# EAGLE design controller (EAGLE 6.4)
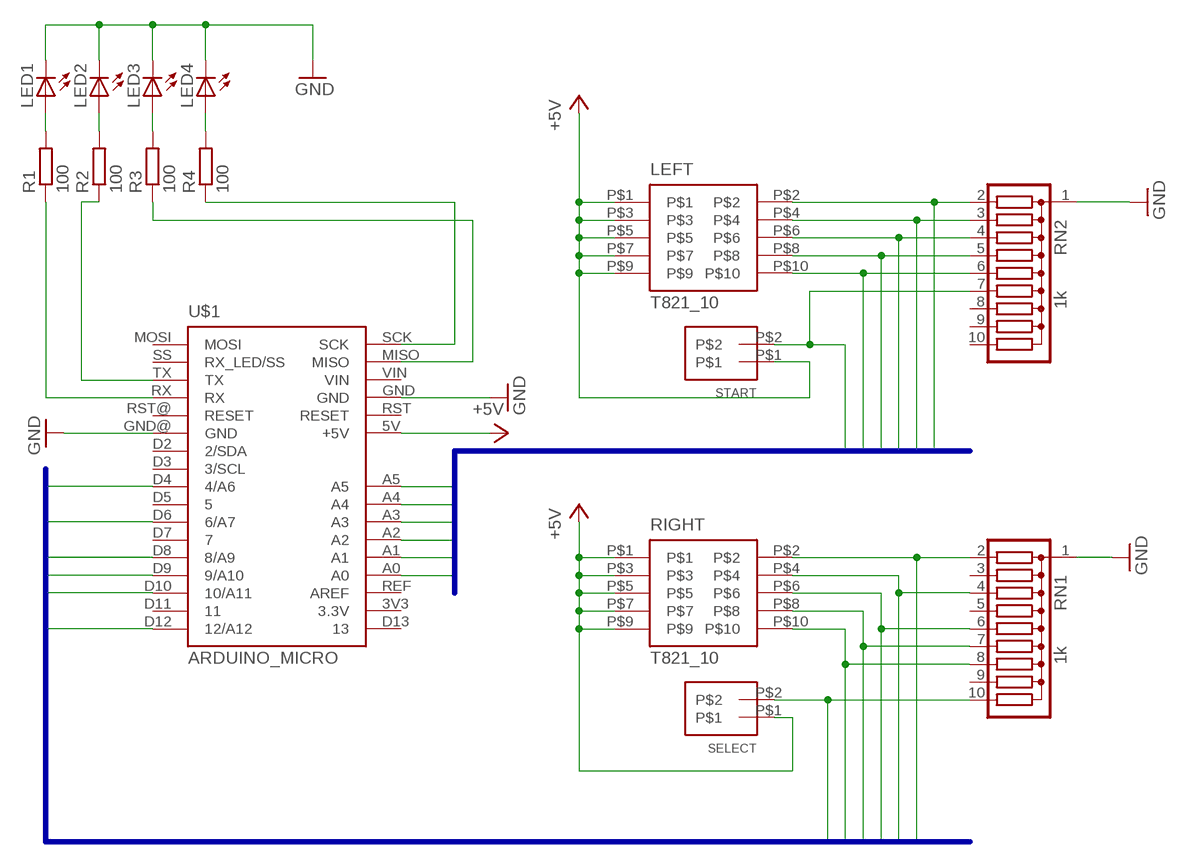
[diagram p0: schematic, sheet 1]

## Parts
LED1  LED5MM  [LED5MM]
LED2  LED5MM  [LED5MM]
LED3  LED5MM  [LED5MM]
LED4  LED5MM  [LED5MM]
LEFT  T821_10  [T821_10]
R1  100  R-EU_0204/7  [0204/7]
R2  100  R-EU_0204/7  [0204/7]
R3  100  R-EU_0204/7  [0204/7]
R4  100  R-EU_0204/7  [0204/7]
RIGHT  T821_10  [T821_10]
RN1  1k  G09R  [SIL10]
RN2  1k  G09R  [SIL10]
SELECT  100MIL_2POS  [100MIL_2POS]
START  100MIL_2POS  [100MIL_2POS]
U$1  ARDUINO_MICRO  [ARDUINO_MICRO]

## Nets
+5V: LEFT.P$1 LEFT.P$3 LEFT.P$5 LEFT.P$7 LEFT.P$9 RIGHT.P$1 RIGHT.P$3 RIGHT.P$5 RIGHT.P$7 RIGHT.P$9 SELECT.P$1 START.P$1 U$1.5V(+5V)
B0: LEFT.P$2 RN2.2 U$1.A0
B1: LEFT.P$4 RN2.3 U$1.A1
B2: LEFT.P$6 RN2.4 U$1.A2
B3: LEFT.P$8 RN2.5 U$1.A3
B4: LEFT.P$10 RN2.6 U$1.A4
B5: RN2.7 START.P$2 U$1.A5
B6: RIGHT.P$2 RN1.2 U$1.D4(4/A6)
B7: RIGHT.P$4 RN1.4 U$1.D6(6/A7)
B8: RIGHT.P$6 RN1.6 U$1.D8(8/A9)
B9: RIGHT.P$8 RN1.7 U$1.D9(9/A10)
B10: RIGHT.P$10 RN1.8 U$1.D10(10/A11)
B11: RN1.10 SELECT.P$2 U$1.D12(12/A12)
GND: LED1.K(C) LED2.K(C) LED3.K(C) LED4.K(C) RN1.1 RN2.1 U$1.GND U$1.GND@(GND)
N$1: LED1.A R1.2
N$2: LED2.A R2.2
N$3: LED3.A R3.2
N$4: LED4.A R4.2
N$6: R1.1 U$1.RX
N$7: R2.1 U$1.TX
N$8: R4.1 U$1.SCK
N$9: R3.1 U$1.MISO
Unconnected: RN1.3 RN1.5 RN1.9 RN2.8 RN2.9 RN2.10 U$1.3V3(3.3V) U$1.D2(2/SDA) U$1.D3(3/SCL) U$1.D5 U$1.D7 U$1.D11 U$1.D13 U$1.MOSI U$1.REF(AREF) U$1.RST(RESET) U$1.RST@(RESET) U$1.SS(RX_LED/SS) U$1.VIN

## Buses
B[0..5]
B[6..11]

## Library data of the parts
LED1-LED4 = led:LED: LED OSRAM: - CHIPLED LG R971, LG N971, LY N971, LG Q971, LY Q971, LO R971, LY R971 LH N974, LH R974 LS Q976, LO Q976, LY Q976 LO Q996 - Hyper CHIPLED LW Q18S LB Q993, LB Q99A, LB R99A - SideLED LS A670, LO A670, LY A670, LG A670, LP A670 LB A673, LV A673, LT A673, LW A673 LH A674 LY A675 LS A676, LA A676, LO A676, LY A676, LW A676 LS A679, LY A679, LG A679 - Hyper Micro SIDELED® LS Y876, LA Y876, LO Y876, LY Y876 LT Y87S - SmartLED LW L88C, LW L88S LB L89C, LB L89S, LG L890 LS L89K, LO L89K, LY L89K LS L896, LA L896, LO L896, LY L896 - TOPLED LS T670, LO T670, LY T670, LG T670, LP T670 LSG T670, LSP T670, LSY T670, LOP T670, LYG T670 LG T671, LOG T671, LSG T671 LB T673, LV T673, LT T673, LW T673 LH T674 LS T676, LA T676, LO T676, LY T676, LB T676, LH T676, LSB T676, LW T676 LB T67C, LV T67C, LT T67C, LS T67K, LO T67K, LY T67K, LW E67C LS E67B, LA E67B, LO E67B, LY E67B, LB E67C, LV E67C, LT E67C LW T67C LS T679, LY T679, LG T679 LS T770, LO T770, LY T770, LG T770, LP T770 LB T773, LV T773, LT T773, LW T773 LH T774 LS E675, LA E675, LY E675, LS T675 LS T776, LA T776, LO T776, LY T776, LB T776 LHGB T686 LT T68C, LB T68C - Hyper Mini TOPLED® LB M676 - Mini TOPLED Santana® LG M470 LS M47K, LO M47K, LY M47K Source: http://www.osram.convergy.de LUXEON: - LUMILED® LXK2-PW12-R00, LXK2-PW12-S00, LXK2-PW14-U00, LXK2-PW14-V00 LXK2-PM12-R00, LXK2-PM12-S00, LXK2-PM14-U00 LXK2-PE12-Q00, LXK2-PE12-R00, LXK2-PE12-S00, LXK2-PE14-T00, LXK2-PE14-U00 LXK2-PB12-K00, LXK2-PB12-L00, LXK2-PB12-M00, LXK2-PB14-N00, LXK2-PB14-P00, LXK2-PB14-Q00 LXK2-PR12-L00, LXK2-PR12-M00, LXK2-PR14-Q00, LXK2-PR14-R00 LXK2-PD12-Q00, LXK2-PD12-R00, LXK2-PD12-S00 LXK2-PH12-R00, LXK2-PH12-S00 LXK2-PL12-P00, LXK2-PL12-Q00, LXK2-PL12-R00 Source: www.luxeon.com KINGBRIGHT: KA-3528ASYC Source: www.kingbright.com
LEFT RIGHT = controller:T821_10
R1-R4 = resistor:R-EU_: RESISTOR, European symbol
RN1 RN2 = resistor-sil:G09R: SIL RESISTOR; OC_FARNELL: unknown; OC_NEWARK: unknown
SELECT START = controller:100MIL_2POS
U$1 = controller:ARDUINO_MICRO

## Board
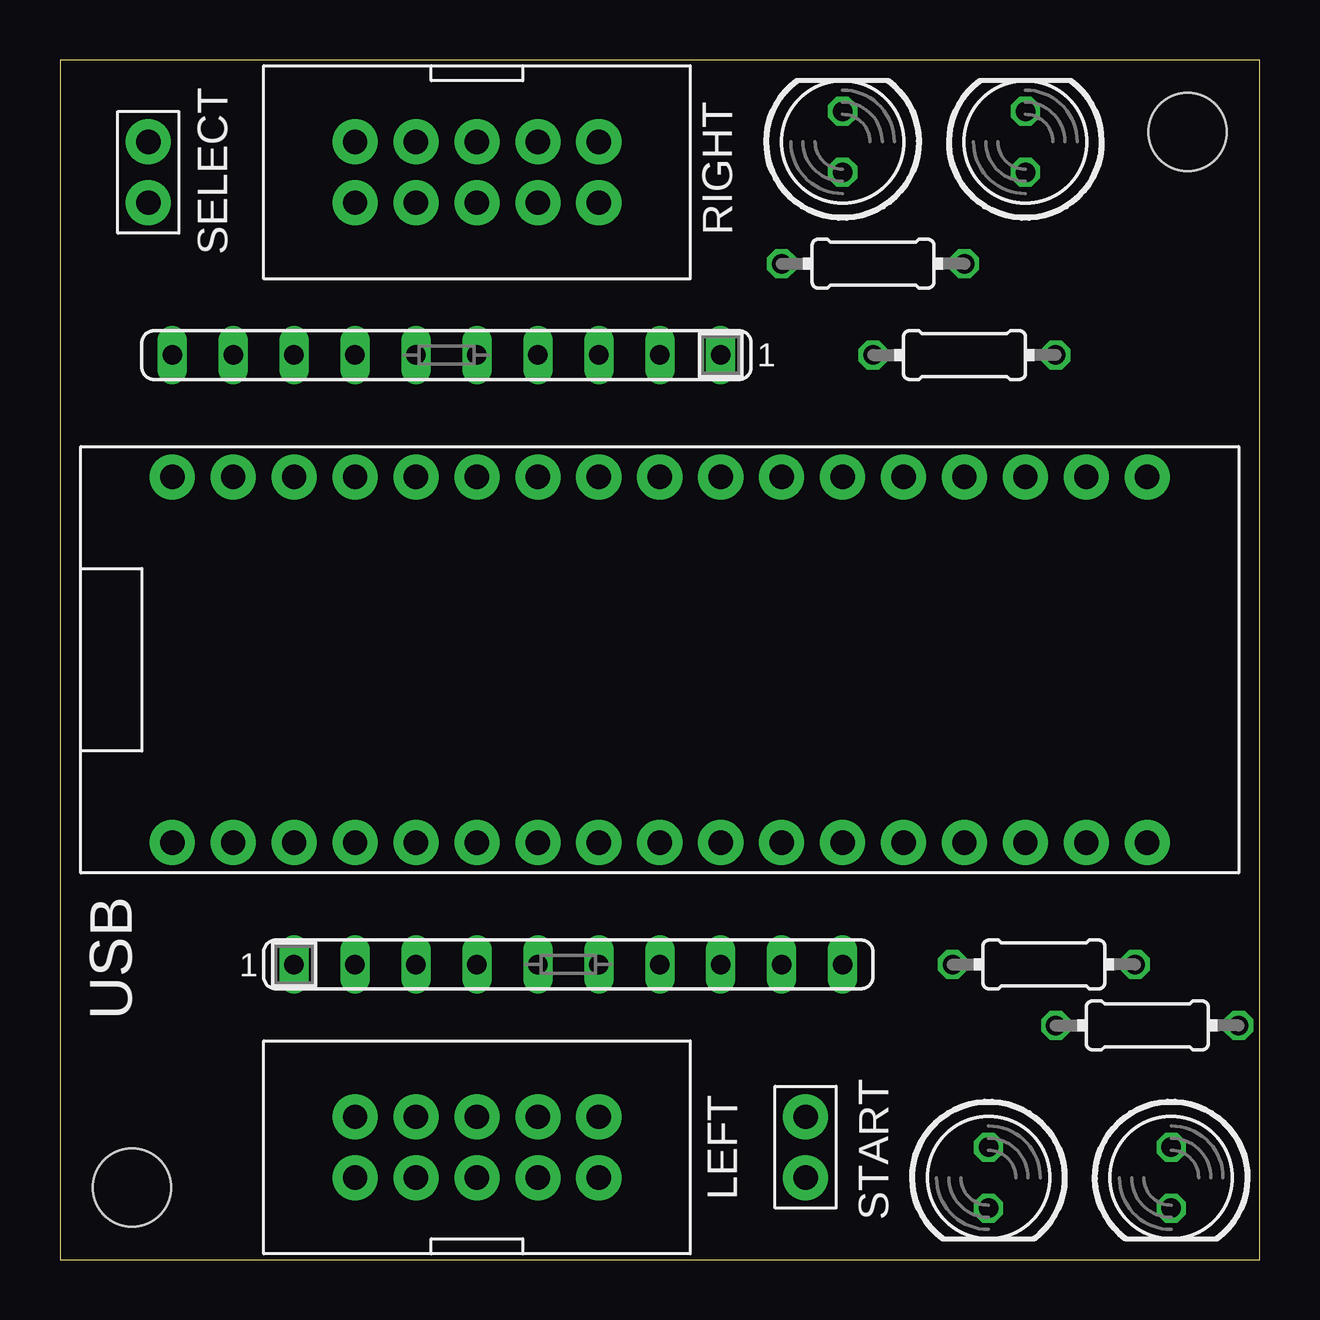
[diagram p1: board, top side]
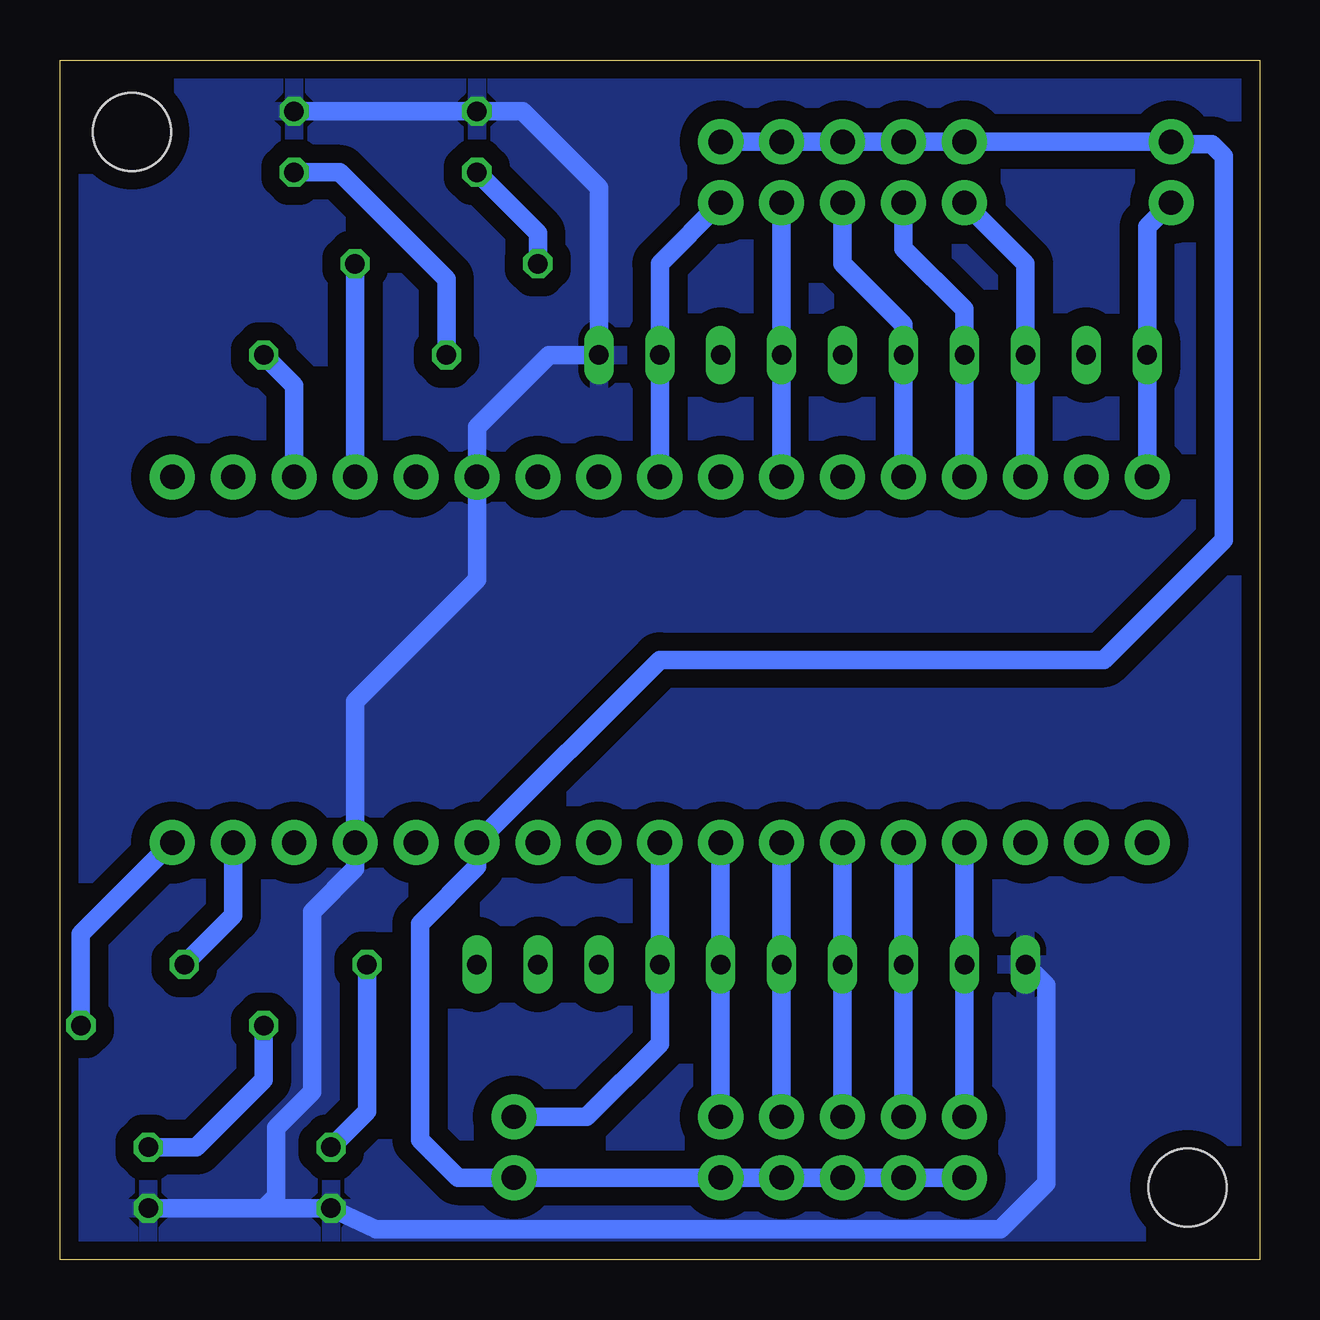
[diagram p2: board, bottom side, seen from below]

Size 50 x 50 mm. Coordinates in mm from the lower left corner, seen from the top.
Outline: 0,0 50,0 50,50 0,50 0,0
Copper layers (1*16): Top 0.035mm / dielectric 0.2mm / Bottom 0.035mm
Design rules "SeeedStudio_DRU_no_angle_20130527 *": minimum track width 6mil, minimum drill 12mil, track to track 6mil, track to pad 6mil, pad to pad 6mil, via to via 6mil, smd to smd 0mil, copper to edge 10mil, drill to drill 10mil, minimum pad ring 6mil, minimum via ring 6mil, stop-mask expansion 2mil, vias tented up to drill 25mil, thermal gap 10mil
Holes 3.26 mm at 3,3 47,47

### Footprints (pad centres in the part's own frame; a part is rotated, then mirrored left to right if it is on the bottom)
LED5MM = drill 0.813 octagon: A -1.27,0; K 1.27,0
T821_10 = drill 1.016 pad 1.88: P$1 -5.08,-1.27; P$2 -5.08,1.27; P$3 -2.54,-1.27; P$4 -2.54,1.27; P$5 0,-1.27; P$6 0,1.27; P$7 2.54,-1.27; P$8 2.54,1.27; P$9 5.08,-1.27; P$10 5.08,1.27
0204/7 = drill 0.813 octagon: 1 -3.81,0; 2 3.81,0
SIL10 = drill 0.813 long: 1 -11.43,0; 2 -8.89,0; 3 -6.35,0; 4 -3.81,0; 5 -1.27,0; 6 1.27,0; 7 3.81,0; 8 6.35,0; 9 8.89,0; 10 11.43,0
100MIL_2POS = drill 1.016 pad 1.88: P$1 -1.27,0; P$2 1.27,0
ARDUINO_MICRO = drill 1.016 pad 1.88: 3V3 7.62,-17.78; 5V 7.62,7.62; A0 7.62,-12.7; A1 7.62,-10.16; A2 7.62,-7.62; A3 7.62,-5.08; A4 7.62,-2.54; A5 7.62,0; D2 -7.62,5.08; D3 -7.62,2.54; D4 -7.62,0; D5 -7.62,-2.54; D6 -7.62,-5.08; D7 -7.62,-7.62; D8 -7.62,-10.16; D9 -7.62,-12.7; D10 -7.62,-15.24; D11 -7.62,-17.78; D12 -7.62,-20.32; D13 7.62,-20.32; GND 7.62,12.7; GND@ -7.62,7.62; MISO 7.62,17.78; MOSI -7.62,20.32; NC 7.62,5.08; NC@ 7.62,2.54; REF 7.62,-15.24; RST 7.62,10.16; RST@ -7.62,10.16; RX -7.62,12.7; SCK 7.62,20.32; SS -7.62,17.78; TX -7.62,15.24; VIN 7.62,15.24

### Placement (x,y rotation side)
LED1  32.62,46.59 90 top
LED2  40.24,46.59 90 top
LED3  38.7,3.41 270 top
LED4  46.32,3.41 270 top
LEFT  17.38,4.68 0 top
R1  33.89,41.51 180 top
R2  37.7,37.7 180 top
R3  41.01,12.3 180 top
R4  45.32,9.76 180 top
RIGHT  17.38,45.32 180 top
RN1  16.11,37.7 180 top
RN2  21.19,12.3 0 top
SELECT  3.68,45.32 270 top
START  31.08,4.68 90 top
U$1  25,25 270 top

### Tracks (layer width: path | path; a pad name or v marks a point on that pad's centre or on a via)
+5V
  Bottom 0.762: RIGHT.P$1 RIGHT.P$3 RIGHT.P$5 RIGHT.P$7 RIGHT.P$9 SELECT.P$1 3.59,46.5 2,46.5 1.5,46 1.5,30 6.5,25 25,25 U$1.5V 32.62,16.38 35,14 35,5 33.41,3.41 START.P$1 LEFT.P$9 LEFT.P$7 LEFT.P$5 LEFT.P$3 LEFT.P$1
B0
  Bottom 0.762: RN2.2 U$1.A0 LEFT.P$2
B1
  Bottom 0.762: U$1.A1 RN2.3 LEFT.P$4
B2
  Bottom 0.762: U$1.A2 RN2.4 LEFT.P$6
B3
  Bottom 0.762: U$1.A3 RN2.5 LEFT.P$8
B4
  Bottom 0.762: U$1.A4 RN2.6 LEFT.P$10
B5
  Bottom 0.762: U$1.A5 RN2.7 25,9 28.05,5.95 START.P$2
B6
  Bottom 0.762: RIGHT.P$2 25,41.51 RN1.2 U$1.D4
B7
  Bottom 0.762: U$1.D6 RN1.4 RIGHT.P$4
B8
  Bottom 0.762: U$1.D8 RN1.6 14.84,38.97 17.38,41.51 RIGHT.P$6
B9
  Bottom 0.762: U$1.D9 RN1.7 12.3,39.6 14.84,42.15 RIGHT.P$8
B10
  Bottom 0.762: U$1.D10 RN1.8 9.76,41.51 RIGHT.P$10
B11
  Bottom 0.762: U$1.D12 RN1.10 4.68,43.05 SELECT.P$2
GND
  Bottom 0.762: LED2.K LED1.K 30.71,47.86 27.54,44.69 RN1.1 29.61,37.7 32.62,34.69 U$1.GND@ 32.62,28.34 37.7,23.26 U$1.GND 37.7,16.3 39.5,14.5 39.5,7 41,5.5 41,2.64 41.5,2.14 | RN2.1 8.89,11.43 8.89,3.17 10.79,1.27 36.83,1.27 LED3.K 41.5,2.14 | 41.5,2.14 LED4.K
  pour Bottom (isolate 0.762): 0,0 50,0 50,50 0,50
N$1
  Bottom 0.762: R1.2 30.08,42.78 LED1.A
N$2
  Bottom 0.762: R2.2 33.89,40.88 38.34,45.32 LED2.A
N$3
  Bottom 0.762: R3.2 37.2,6.18 LED3.A
N$4
  Bottom 0.762: R4.2 41.51,7.49 44.32,4.68 LED4.A
N$5
  pour Bottom (isolate 0.762): 0,50 50,50 50,0 0,0
N$6
  Bottom 0.762: R1.1 U$1.RX
N$7
  Bottom 0.762: U$1.TX 40.24,36.43 R2.1
N$8
  Bottom 0.762: U$1.SCK 49.13,13.57 R4.1
N$9
  Bottom 0.762: U$1.MISO 42.78,14.34 R3.1

### Text on the board
tNames: USB